# EAGLE board Flightcontroller (EAGLE 9.3.2)
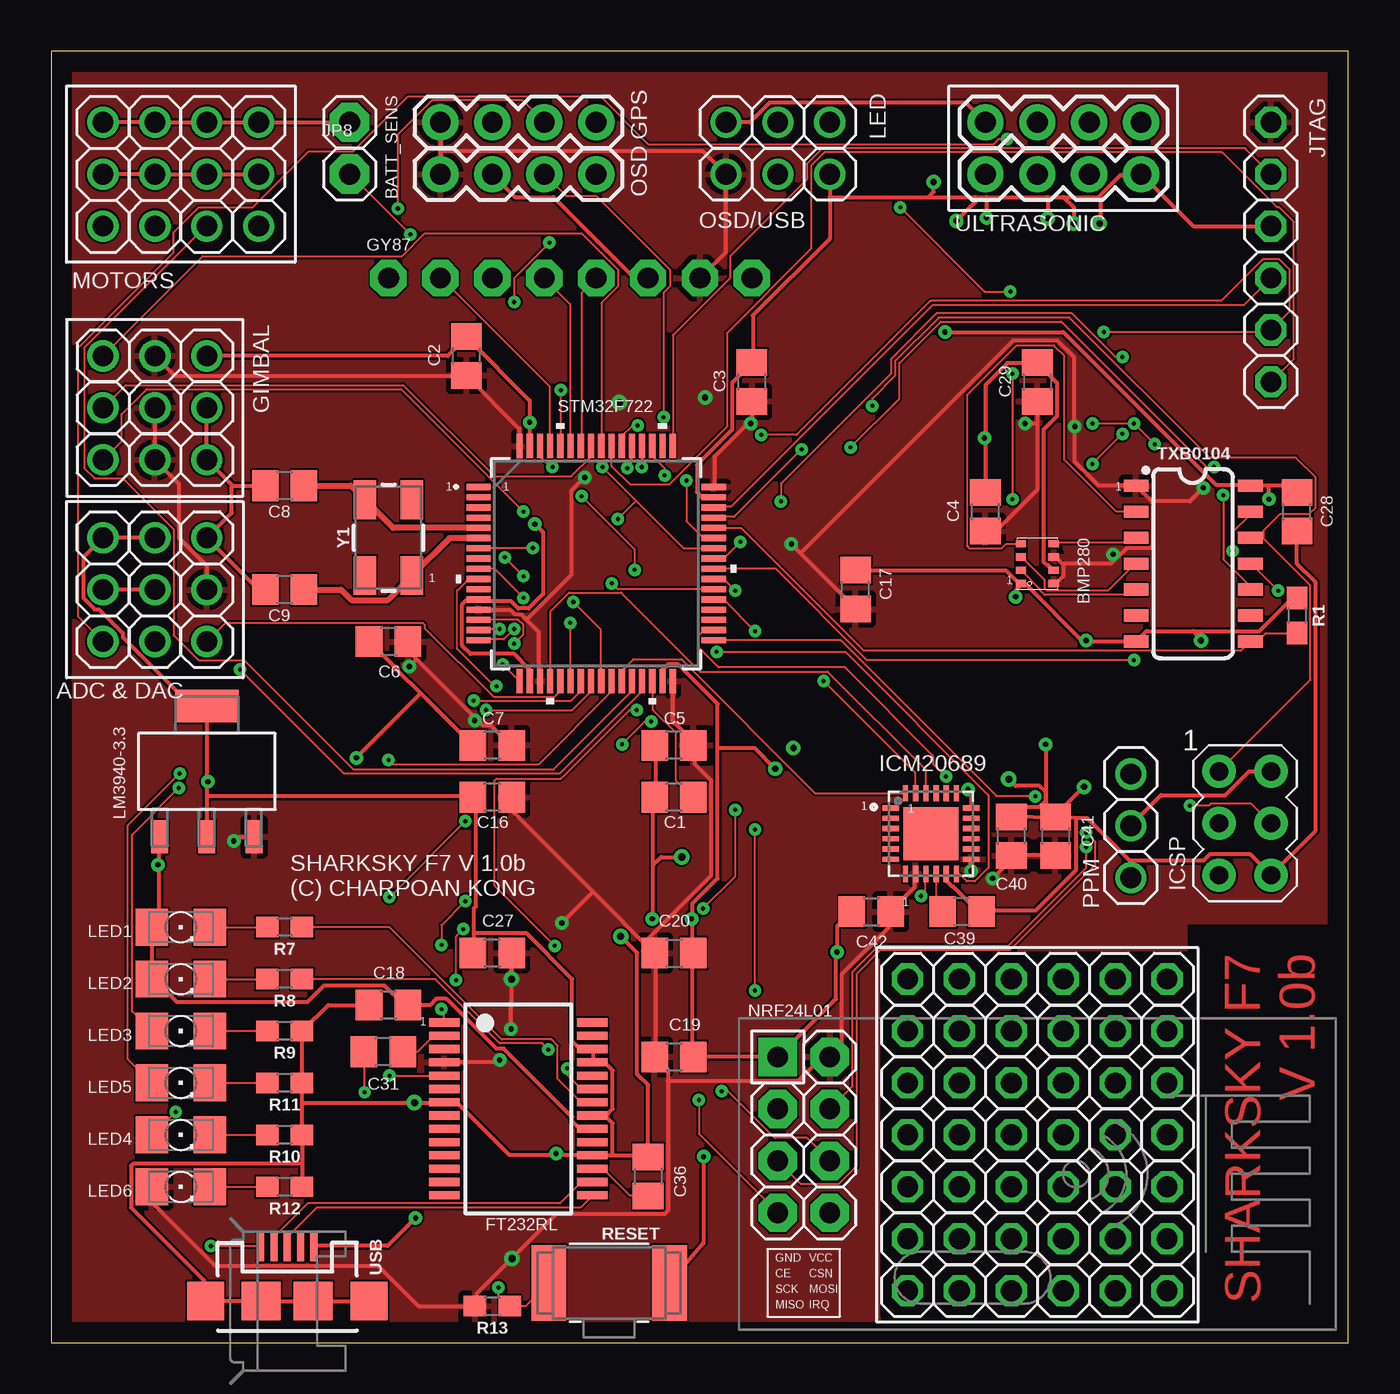
[diagram p10: board, top side]
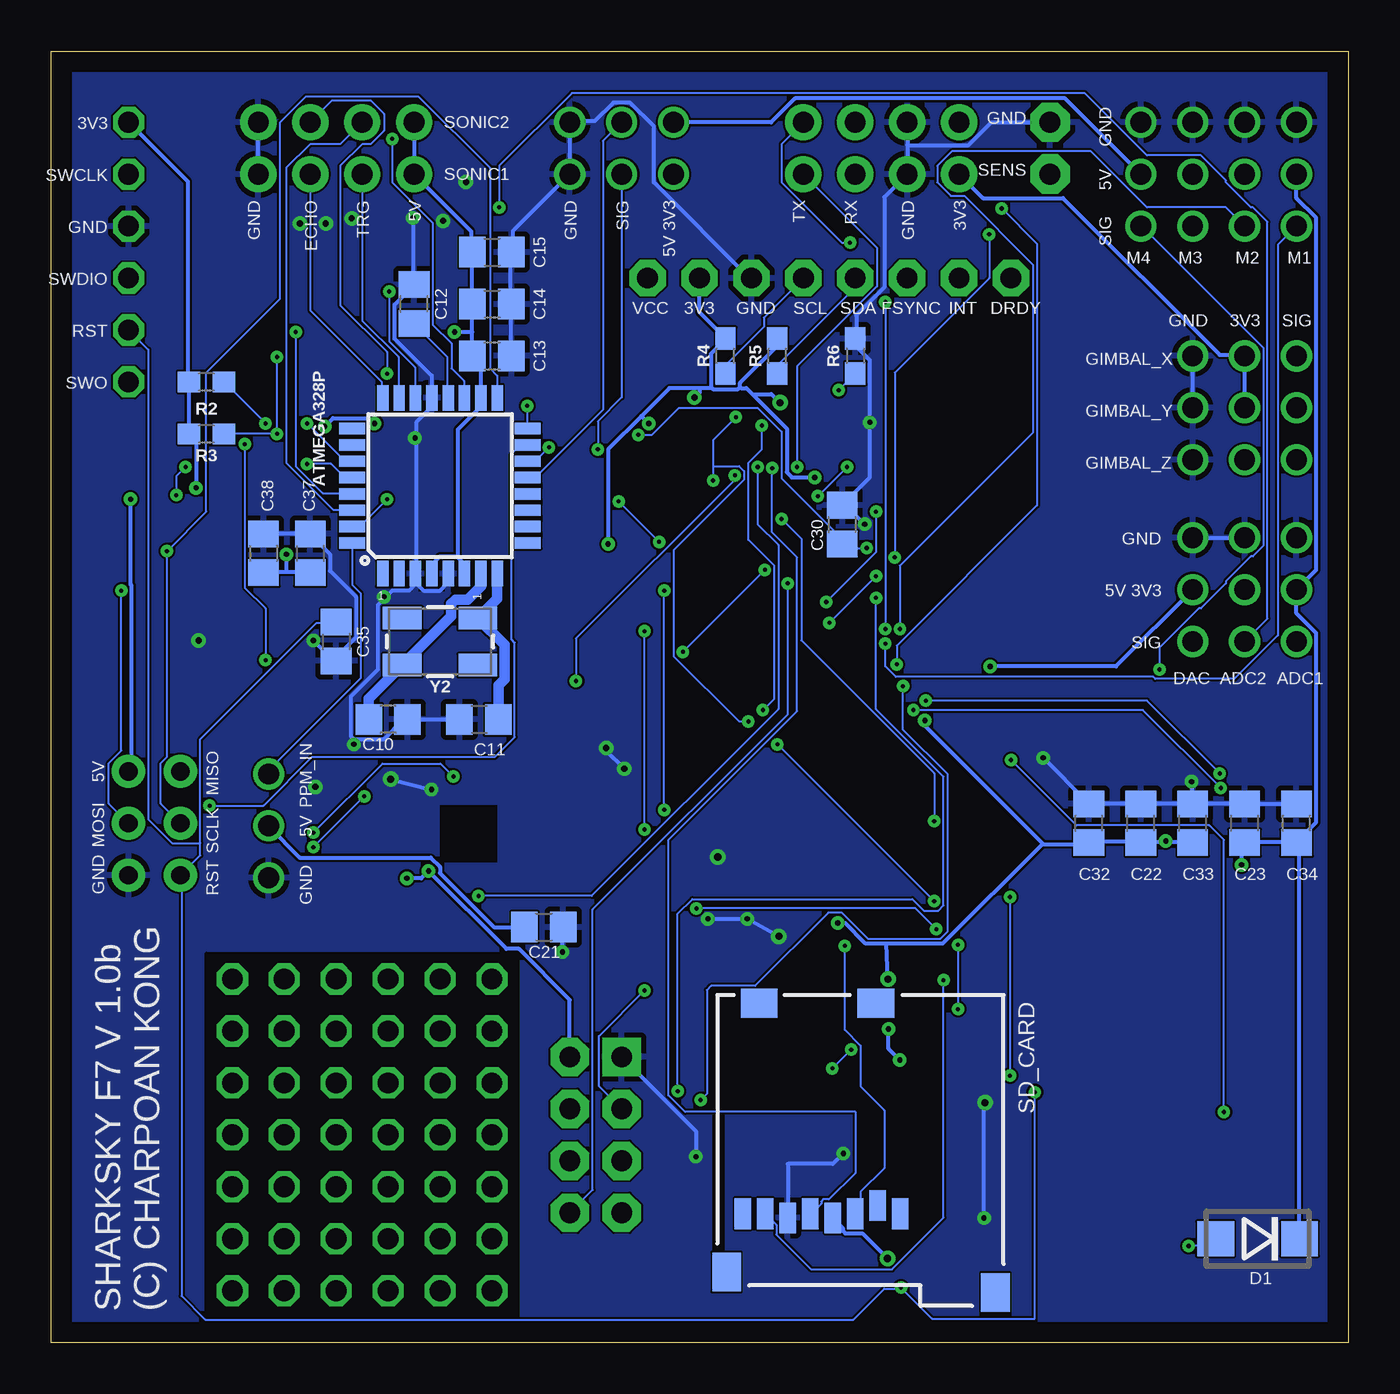
[diagram p11: board, bottom side, seen from below]

Size 63.48 x 63.17 mm. Coordinates in mm from the lower left corner, seen from the top.
Outline: 0,0 63.48,0 63.48,63.17 0,63.17 0,0
Copper layers (1*16): Top 0.035mm / dielectric 0.62mm / Bottom 0.035mm
Design rules "default *": minimum track width 4mil, minimum drill 8mil, track to track 4mil, track to pad 4mil, pad to pad 4mil, via to via 4mil, smd to smd 4mil, copper to edge 40mil, drill to drill 6mil, minimum pad ring 10mil, minimum via ring 8mil, stop-mask expansion 4mil, vias tented up to drill 14mil, thermal gap 10mil
Net classes: 0 default: width 0.102 mm, drill 0.102 mm, clearance 0.102 mm; 1 Supply: width 0.203 mm, drill 0.254 mm, clearance 0.102 mm
tKeepout: area 40.6,1.3 to 55.9,19.1; area 41.7,23.5 to 44.5,26.3; area 55.5,0.3 to 63.4,20.2
bKeepout: area 40.6,1.3 to 55.9,19.1; area 41.7,23.5 to 44.5,26.3
tRestrict: area 40.6,1.3 to 55.9,19.1; area 41.7,23.5 to 44.5,26.3; area 55.6,0.3 to 63.4,20.4
bRestrict: area 40.6,1.3 to 55.9,19.1; area 41.7,23.5 to 44.5,26.3

## Footprints (pad centres in the part's own frame; a part is rotated, then mirrored left to right if it is on the bottom)
1X03 = drill 1.016: 1 -2.54,0; 2 0,0; 3 2.54,0
TQFP32-08 = smd 1.27 x 0.559: 1 -4.293,2.8; 2 -4.293,2; 3 -4.293,1.2; 4 -4.293,0.4; 5 -4.293,-0.4; 6 -4.293,-1.2; 7 -4.293,-2; 8 -4.293,-2.8; 17 4.293,-2.8; 18 4.293,-2; 19 4.293,-1.2; 20 4.293,-0.4; 21 4.293,0.4; 22 4.293,1.2; 23 4.293,2; 24 4.293,2.8 | smd 0.559 x 1.27: 9 -2.8,-4.293; 10 -2,-4.293; 11 -1.2,-4.293; 12 -0.4,-4.293; 13 0.4,-4.293; 14 1.2,-4.293; 15 2,-4.293; 16 2.8,-4.293; 25 2.8,4.293; 26 2,4.293; 27 1.2,4.293; 28 0.4,4.293; 29 -0.4,4.293; 30 -1.2,4.293; 31 -2,4.293; 32 -2.8,4.293
1X01 = drill 1.016 pad 1.93 octagon: 1 0,0
BMP280 = smd 0.35 x 0.5: 1 0.975,-0.8; 2 0.325,-0.8; 3 -0.325,-0.8; 4 -0.975,-0.8; 5 -0.975,0.8; 6 -0.325,0.8; 7 0.325,0.8; 8 0.975,0.8
C0805 = smd 1.3 x 1.5: 1 -0.95,0; 2 0.95,0
DO214BA = smd 1.8 x 1.7: A 2.05,0; C -2.05,0
SSOP28 = smd 0.4 x 1.5: 1 -4.225,-3.625; 2 -3.575,-3.625; 3 -2.925,-3.625; 4 -2.275,-3.625; 5 -1.625,-3.625; 6 -0.975,-3.625; 7 -0.325,-3.625; 8 0.325,-3.625; 9 0.975,-3.625; 10 1.625,-3.625; 11 2.275,-3.625; 12 2.925,-3.625; 13 3.575,-3.625; 14 4.225,-3.625; 15 4.225,3.625; 16 3.575,3.625; 17 2.925,3.625; 18 2.275,3.625; 19 1.625,3.625; 20 0.975,3.625; 21 0.325,3.625; 22 -0.325,3.625; 23 -0.975,3.625; 24 -1.625,3.625; 25 -2.275,3.625; 26 -2.925,3.625; 27 -3.575,3.625; 28 -4.225,3.625
1X04-BIG = drill 1.016 pad 1.778: 1 0,0; 2 2.54,0; 3 5.08,0; 4 7.62,0
1X08-CLEANBIG = drill 1.016 pad 1.778 octagon: 1 -8.89,0; 2 -6.35,0; 3 -3.81,0; 4 -1.27,0; 5 1.27,0; 6 3.81,0; 7 6.35,0; 8 8.89,0
QFN50P400X400X95-25N = smd 0.79 x 0.26: 1 -1.97,1.25; 2 -1.97,0.75; 3 -1.97,0.25; 4 -1.97,-0.25; 5 -1.97,-0.75; 6 -1.97,-1.25; 13 1.97,-1.25; 14 1.97,-0.75; 15 1.97,-0.25; 16 1.97,0.25; 17 1.97,0.75; 18 1.97,1.25 | smd 0.26 x 0.79: 7 -1.25,-1.97; 8 -0.75,-1.97; 9 -0.25,-1.97; 10 0.25,-1.97; 11 0.75,-1.97; 12 1.25,-1.97; 19 1.25,1.97; 20 0.75,1.97; 21 0.25,1.97; 22 -0.25,1.97; 23 -0.75,1.97; 24 -1.25,1.97 | smd 2.7 x 2.6: 25 0,0
AVRISP = drill 0.9 pad 1.626: 1 -1.27,2.54; 2 1.27,2.54; 3 -1.27,0; 4 1.27,0; 5 -1.27,-2.54; 6 1.27,-2.54
1X06 = drill 1.016 octagon: 1 -6.35,0; 2 -3.81,0; 3 -1.27,0; 4 1.27,0; 5 3.81,0; 6 6.35,0
1206 = smd 1.6 x 1.803: A -1.422,0; C 1.422,0
SOT230P696X180-4N = smd 1.6 x 0.838: 1 -3.2,2.311; 2 -3.2,0; 3 -3.2,-2.311 | smd 1.6 x 3.099: 4 3.2,0
NRF24L01+ = drill 1.016 pad 1.88 octagon: CE -11.43,1.27; CSN -8.89,1.27; IRQ -8.89,-3.81; MISO -11.43,-3.81; MOSI -8.89,-1.27; SCK -11.43,-1.27; VCC -8.89,3.81 | drill 1.016 pad 1.88 square: GND -11.43,3.81
0603 = smd 1.1 x 1: 1 -0.85,0; 2 0.85,0
BTN_CK_KSS = smd 1.7 x 3.7: P$1 -2.95,0; P$2 2.95,0
3M_2908-05WB-MG = smd 0.8 x 1.5: 1 -1.94,3.1; 2 -0.84,2.7; 3 0.26,3.1; 4 1.36,3.3; 5 2.46,3.1; 6 3.56,3.3; 7 4.66,3.1; 8 5.76,3.1 | smd 1.4 x 1.9: P$1 6.55,5.95; P$2 -6.6,6.95 | smd 1.8 x 1.4: P$3 4.95,-7.2; P$4 -0.75,-7.2
LQFP64-10X10MM = smd 1.194 x 0.305: 1 -5.75,3.75; 2 -5.75,3.25; 3 -5.75,2.75; 4 -5.75,2.25; 5 -5.75,1.75; 6 -5.75,1.25; 7 -5.75,0.75; 8 -5.75,0.25; 9 -5.75,-0.25; 10 -5.75,-0.75; 11 -5.75,-1.25; 12 -5.75,-1.75; 13 -5.75,-2.25; 14 -5.75,-2.75; 15 -5.75,-3.25; 16 -5.75,-3.75; 33 5.75,-3.75; 34 5.75,-3.25; 35 5.75,-2.75; 36 5.75,-2.25; 37 5.75,-1.75; 38 5.75,-1.25; 39 5.75,-0.75; 40 5.75,-0.25; 41 5.75,0.25; 42 5.75,0.75; 43 5.75,1.25; 44 5.75,1.75; 45 5.75,2.25; 46 5.75,2.75; 47 5.75,3.25; 48 5.75,3.75 | smd 0.305 x 1.194: 17 -3.75,-5.75; 18 -3.25,-5.75; 19 -2.75,-5.75; 20 -2.25,-5.75; 21 -1.75,-5.75; 22 -1.25,-5.75; 23 -0.75,-5.75; 24 -0.25,-5.75; 25 0.25,-5.75; 26 0.75,-5.75; 27 1.25,-5.75; 28 1.75,-5.75; 29 2.25,-5.75; 30 2.75,-5.75; 31 3.25,-5.75; 32 3.75,-5.75; 49 3.75,5.75; 50 3.25,5.75; 51 2.75,5.75; 52 2.25,5.75; 53 1.75,5.75; 54 1.25,5.75; 55 0.75,5.75; 56 0.25,5.75; 57 -0.25,5.75; 58 -0.75,5.75; 59 -1.25,5.75; 60 -1.75,5.75; 61 -2.25,5.75; 62 -2.75,5.75; 63 -3.25,5.75; 64 -3.75,5.75
SO14 = smd 0.6 x 1.2: 1 -3.81,-2.8; 2 -2.54,-2.8; 3 -1.27,-2.8; 4 0,-2.8; 5 1.27,-2.8; 6 2.54,-2.8; 7 3.81,-2.8; 8 3.81,2.8; 9 2.54,2.8; 10 1.27,2.8; 11 0,2.8; 12 -1.27,2.8; 13 -2.54,2.8; 14 -3.81,2.8
USB-MICROB = smd 1.4 x 0.35: D+ -2.65,0; D- -2.65,-0.65; GND -2.65,1.3; ID -2.65,0.65; VBUS -2.65,-1.3 | smd 1.9 x 1.8: MT1 0,-4; MT2 0,4 | smd 1.9 x 1.9: P$1 0,-1.27; P$2 0,1.27
CRYSTAL-SMD-5X3.2-4PAD = smd 1.9 x 1.1: 1 -1.85,-1.15; 2 1.85,-1.15; 3 1.85,1.15; 4 -1.85,1.15

## Placement (x,y rotation side)
ADC1  [1X03]  2.54,36.83 90 top
ADC2  [1X03]  5.08,36.83 90 top
ATMEGA328P  ATMEGA328P_TQFP  [TQFP32-08]  44.45,41.91 90 bottom
BATT_SENS  [1X01]  14.61,59.69 0 top
BMP280  BMP280  [BMP280]  48.26,38.1 270 top
C1  4.7uF  [C0805]  30.48,26.67 180 top
C2  4.7uF  [C0805]  20.32,48.26 90 top
C3  100nF  [C0805]  34.29,46.99 90 top
C4  100nF  [C0805]  45.72,40.64 90 top
C5  100nF  [C0805]  30.48,29.21 180 top
C6  100nF  [C0805]  16.51,34.29 180 top
C7  100nF  [C0805]  21.59,29.21 180 top
C8  10pF  [C0805]  11.43,41.91 180 top
C9  10pF  [C0805]  11.43,36.83 180 top
C10  10pF  [C0805]  46.99,30.48 180 bottom
C11  10pF  [C0805]  42.55,30.48 0 bottom
C12  100nF  [C0805]  45.72,50.8 90 bottom
C13  4.7uF  [C0805]  41.91,48.26 0 bottom
C14  1uF  [C0805]  41.91,50.8 0 bottom
C15  1uF  [C0805]  41.91,53.34 0 bottom
C16  1uF  [C0805]  21.59,26.67 180 top
C17  1uF  [C0805]  39.37,36.83 90 top
C18  100nF  [C0805]  16.51,16.51 180 top
C19  100nF  [C0805]  30.48,13.97 0 top
C20  4.7uF  [C0805]  30.48,19.05 0 top
C21  4.7uF  [C0805]  39.37,20.32 0 bottom
C22  10uF  [C0805]  10.16,25.4 90 bottom
C23  10uF  [C0805]  5.08,25.4 90 bottom
C27  4.7uF  [C0805]  21.59,19.05 180 top
C28  100nF  [C0805]  60.96,40.64 90 top
C29  100nF  [C0805]  48.26,46.99 270 top
C30  100nF  [C0805]  24.77,40.01 90 bottom
C31  100nF  [C0805]  16.26,14.22 180 top
C32  10uF  [C0805]  12.7,25.4 90 bottom
C33  10uF  [C0805]  7.62,25.4 90 bottom
C34  1uF  [C0805]  2.54,25.4 90 bottom
C35  100nF  [C0805]  49.53,34.29 270 bottom
C36  100nF  [C0805]  29.21,8.13 270 top
C37  100nF  [C0805]  50.8,38.61 270 bottom
C38  100nF  [C0805]  53.09,38.61 270 bottom
C39  0.47uF  [C0805]  44.58,21.08 180 top
C40  10nF  [C0805]  46.99,24.77 90 top
C41  100nF  [C0805]  49.15,24.77 270 top
C42  2.2uF  [C0805]  40.13,21.08 0 top
D1  [DO214BA]  4.44,5.08 180 bottom
DAC  [1X03]  7.62,36.83 90 top
FT232RL  FT232RL  [SSOP28]  22.86,11.43 270 top
GIMBAL_X  [1X03]  5.08,48.26 0 top
GIMBAL_Y  [1X03]  5.08,45.72 0 top
GIMBAL_Z  [1X03]  5.08,43.18 0 top
GPS  1X4-BIG  [1X04-BIG]  19.05,59.69 0 top
GY87  [1X08-CLEANBIG]  25.4,52.07 0 top
ICM20689  ICM-20689  [QFN50P400X400X95-25N]  43.05,24.89 0 top
ICSP  AVRISP-6  [AVRISP]  58.42,25.4 0 top
JP1  [1X06]  48.26,17.78 0 top
JP2  [1X06]  48.26,15.24 0 top
JP3  [1X06]  48.26,12.7 0 top
JP4  [1X06]  48.26,10.16 0 top
JP5  [1X06]  48.26,7.62 0 top
JP6  [1X06]  48.26,5.08 0 top
JP7  [1X06]  48.26,2.54 0 top
JP8  [1X01]  14.61,57.15 0 top
JTAG  [1X06]  59.69,53.34 270 top
LED  [1X03]  35.56,59.69 0 top
LED1  [1206]  6.35,20.32 0 top
LED2  [1206]  6.35,17.78 0 top
LED3  [1206]  6.35,15.24 0 top
LED4  [1206]  6.35,10.16 0 top
LED5  [1206]  6.35,12.7 0 top
LED6  [1206]  6.35,7.62 0 top
LM3940-3.3  LM3940IMPX-3.3/NOPB  [SOT230P696X180-4N]  7.62,27.94 90 top
M1  [1X03]  2.54,57.15 90 top
M2  [1X03]  5.08,57.15 90 top
M3  [1X03]  7.62,57.15 90 top
M4  [1X03]  10.16,57.15 90 top
NRF24L01  NRF24L01+  [NRF24L01+]  46.99,10.16 0 top
OSD  1X4-BIG  [1X04-BIG]  19.05,57.15 0 top
OSD/USB  [1X03]  35.56,57.15 0 top
PPM  [1X03]  52.83,25.27 270 top
R1  10k  [0603]  60.96,35.56 270 top
R2  4.7k  [0603]  55.88,46.99 180 bottom
R3  4.7k  [0603]  55.88,44.45 180 bottom
R4  4.7k  [0603]  30.48,48.26 90 bottom
R5  4.7k  [0603]  27.94,48.26 90 bottom
R6  10k  [0603]  24.13,48.26 270 bottom
R7  1k  [0603]  11.43,20.32 180 top
R8  1k  [0603]  11.43,17.78 180 top
R9  1k  [0603]  11.43,15.24 180 top
R10  1k  [0603]  11.43,10.16 180 top
R11  1k  [0603]  11.43,12.7 180 top
R12  1k  [0603]  11.43,7.62 180 top
R13  10k  [0603]  21.59,1.78 180 top
RESET  [BTN_CK_KSS]  27.3,2.92 0 top
SD_CARD  2908-05WB-MG  [3M_2908-05WB-MG]  23.88,9.4 180 bottom
SONIC1  1X4-BIG  [1X04-BIG]  45.72,59.69 0 top
SONIC2  1X4-BIG  [1X04-BIG]  45.72,57.15 0 top
STM32F722  STM32F7X2RXT  [LQFP64-10X10MM]  26.67,38.1 0 top
TXB0104  TXB0104  [SO14]  55.88,38.1 270 top
USB  [USB-MICROB]  11.56,2.03 270 top
Y1  8MHz  [CRYSTAL-SMD-5X3.2-4PAD]  16.51,39.37 90 top
Y2  16MHz  [CRYSTAL-SMD-5X3.2-4PAD]  44.45,34.29 180 bottom

## Tracks (layer width: path | path; a pad name or v marks a point on that pad's centre or on a via)
A_SPI_MISO  (via drill 0.2)
  Top 0.102: TXB0104.12 59.28,39.37 59.31,39.35 | 59.31,39.35 61.62,37.03 61.62,32.41 ICSP.1 | v40.18,45.82 40.18,46.18 41.3,47.3 41.3,48.01 43.43,50.14 49.84,50.14 56.69,43.28 60.91,43.28 61.87,42.32 61.87,40.84 61.57,40.54 60.15,40.54 59.33,39.73 59.33,39.37 59.31,39.35
  Bottom 0.102: v40.18,45.82 40.18,44.76 ATMEGA328P.16
A_SPI_MOSI  (via drill 0.2)
  Top 0.102: v60.05,36.78 58.73,38.1 TXB0104.11 | v55.73,26.26 56.64,26.26 56.74,26.37 58.73,26.37 ICSP.4
  Bottom 0.102: v60.05,36.78 60.05,28.96 60.66,28.35 60.66,26.37 ICSP.4 | v55.73,26.26 53.09,26.26 50.7,28.65 41.76,28.65 40.79,29.62 40.79,34.24 40.95,34.39 40.95,43.49 40.54,43.89 40.18,43.89 ATMEGA328P.15
A_SPI_NSS  (via drill 0.2)
  Top 0.102: v57.35,41.45 57.35,38.3 58.67,36.98 TXB0104.10 | v56.9,42.82 56.54,42.82 49.43,49.94 43.54,49.94 41.5,47.9 41.5,46.18 v39.12,43.79
  Bottom 0.102: v57.35,41.45 57.35,42.37 v56.9,42.82 | v39.12,43.79 39.78,43.13 40.13,43.13 ATMEGA328P.14
A_SPI_SCLK  (via drill 0.2)
  Top 0.102: v57.81,38.71 57.81,39.62 58.67,40.49 TXB0104.13
  Bottom 0.102: ICSP.3 58.12,26.37 58.12,28.35 57.81,28.65 v57.81,38.71 55.88,40.64 55.88,47.45 52.27,51.05 52.27,59.69 51,60.96 45.52,60.96 42.01,57.46 42.01,47.65 41.66,47.3 41.66,46.23 ATMEGA328P.17
ADC1  (via drill 0.2)
  Top 0.102: v46.79,58.88 46.38,58.88 46.13,58.62 29.21,58.62 26.87,60.96 17.48,60.96 14.78,58.27 12.6,58.27 9.86,55.52 7.21,55.52 5.99,54.3 5.99,53.34 1.32,48.67 1.32,35.51 ADC1.1
  Bottom 0.102: v46.79,58.88 46.79,56.74 44.81,54.76 44.81,49.78 43.89,48.87 43.89,47.65 43.28,47.04 43.28,46.23 ATMEGA328P.19
ADC2  (via drill 0.2)
  Top 0.102: v46.94,51.41 45.67,51.41 v41.55,55.52
  Bottom 0.102: v46.94,51.41 46.94,48.97 45.67,47.7 45.67,46.23 ATMEGA328P.22 | v41.55,55.52 41.55,57.56 38,61.11 12.9,61.11 9.86,58.06 7.21,58.06 5.99,56.85 5.99,56.74 4.77,55.52 4.67,55.52 3.96,54.81 3.96,35.41 ADC2.1
B_SPI_MISO
  Top 0.102: BMP280.5 49.07,39.12 52.78,39.12 53.04,39.37 TXB0104.3
B_SPI_MOSI
  Top 0.102: BMP280.3 47.5,38.41 48.62,37.29 48.62,36.88 48.72,36.78 51.71,36.78 53.04,38.1 TXB0104.4
B_SPI_NSS
  Top 0.102: BMP280.2 47.5,37.74 48.41,36.83 48.41,36.78 48.62,36.58 52.78,36.58 53.04,36.83 TXB0104.5
B_SPI_SCLK
  Top 0.102: TXB0104.2 52.12,40.64 49.58,43.18 49.58,48.26 49.07,48.77 47.24,48.77 44.81,46.33 44.81,38.96 44.91,38.86 46.53,38.86 46.74,39.07 47.45,39.07 BMP280.4
BATTSENS  (via drill 0.2)
  Top 0.102: v25.4,35.2 25.4,32.36 STM32F722.22 | v22.2,38.41 v23.11,37.49 | v17.58,54.2 14.63,57.15 JP8.1
  Bottom 0.102: v23.11,37.49 v25.4,35.2 | v22.2,38.41 22.2,47.45 17.58,52.07 v17.58,54.2
CE  (via drill 0.2)
  Top 0.102: v34.44,34.8 32.92,36.32 32.46,36.32 STM32F722.37 | v34.44,17.22 v34.44,25.1
  Bottom 0.102: v34.44,25.1 v34.44,34.8 | v34.44,17.22 36.68,14.99 36.68,12.55 NRF24L01.CE
DAC_OUT
  Top 0.102: DAC.1 8.53,35.2 18.19,35.2 18.29,35.1 18.29,34.95 21.64,31.6 24.64,31.6 24.89,31.85 24.89,32.31 STM32F722.21
ECHO1_IN  (via drill 0.2)
  Top 0.102: v47.04,47.4 v47.04,41.25
  Bottom 0.102: v47.04,41.25 48.36,39.93 48.72,39.93 ATMEGA328P.31 | v47.04,47.4 47.04,48.46 49.33,50.75 49.33,57.56 48.26,58.62 47.85,58.62 47.19,59.28 47.19,60.1 47.85,60.76 49.73,60.76 SONIC1.3
ECHO2_IN
  Bottom 0.102: SONIC2.3 50.8,50.49 47.3,46.99 47.3,46.23 ATMEGA328P.24
GIMBAL_X
  Top 0.102: GIMBAL_X.1 7.42,53.14 17.17,53.14 18.29,54.25 25.96,54.25 27.74,52.48 27.74,51.66 26.92,50.85 26.92,43.89 STM32F722.56
GIMBAL_Y
  Top 0.102: GIMBAL_Y.1 3.66,46.84 17.22,46.84 21.69,42.37 25.45,42.37 26.42,43.33 STM32F722.57
GIMBAL_Z  (via drill 0.2)
  Top 0.102: v25.55,36.22 26.87,34.9 26.87,32.36 STM32F722.25 | v23.11,40.64 17.12,46.63 4.67,46.63 3.45,45.41 3.45,44.09 GIMBAL_Z.1
  Bottom 0.102: v25.55,36.22 23.11,38.66 v23.11,40.64
GND  (via drill 0.25, 0.3, 0.35)
  Top 0.203: v17.83,6.1 16.46,4.72 12.9,4.72 USB.GND | C5.2 29.57,29.21 29.57,26.67 C1.2 29.46,26.62 29.46,23.37 | 32.61,29.08 32.61,22.71 31.39,21.49 31.39,20.73 | 32.61,29.08 32.61,31.24 30.68,33.17 30.17,33.17 29.92,32.92 STM32F722.31 | 31.39,20.73 31.39,19.05 C20.2 31.39,19 31.39,14.02 C19.2 NRF24L01.GND 38.41,16.82 38.41,19.05 v38.46,19.1 38.46,20.37 39.17,21.08 C42.1 | 29.46,23.37 29.46,20.78 v29.41,20.73 | v31.34,20.73 31.39,20.73 | v31.93,9.09 31.93,4.87 RESET.P$2 | 8.89,41.91 C8.2 | 8.89,41.91 GIMBAL_Z.3 GIMBAL_Y.3 | 18.09,31.75 20.62,29.21 C7.2 | 18.09,31.75 16.97,32.87 16.97,32.92 15.6,34.29 C6.2 | 7.62,27.43 LM3940-3.3.4 7.57,31.19 6.81,31.19 3.5,34.49 3.5,34.7 2.34,35.87 2.13,35.87 1.57,36.42 1.57,38.41 ADC1.3 ADC2.3 | 7.62,27.43 7.62,26.72 | 7.62,26.72 LM3940-3.3.2 | C9.2 10.16,36.83 DAC.3 8.84,40.59 8.84,41.86 8.89,41.91 | v7.67,27.43 7.62,27.43 | v14.94,28.6 18.09,31.75 | 20.68,20.02 20.68,21.23 20.78,21.34 20.78,26.57 20.68,26.67 C16.2 20.57,26.72 7.62,26.72 | 20.68,20.02 20.68,19.05 C27.2 | 27.48,9.14 29.16,9.14 29.21,9.09 C36.1 29.21,12.6 28.68,13.14 28.68,19.07 v27.87,19.87 | 27.48,9.14 26.52,9.14 FT232RL.18 26.42,9.2 24.71,9.2 | 27.48,9.14 27.48,10.72 27.13,11.07 26.52,11.07 FT232RL.21 27.18,11.12 27.48,11.43 27.48,13.31 27.08,13.72 26.62,13.72 FT232RL.25 26.52,13.72 26.52,14.33 FT232RL.26 26.42,14.43 25.81,14.43 25.5,14.73 25.5,17.78 23.27,20.02 20.68,20.02 | USB.MT2 USB.P$2 USB.P$1 USB.MT1 7.47,2.08 7.47,3.05 3.91,6.6 3.91,8.64 4.01,8.74 12.29,8.74 | 12.29,8.74 12.29,10.16 R10.1 12.29,10.21 12.29,11.73 | 12.29,8.74 12.29,7.62 R12.1 | 12.29,11.73 12.29,12.7 R11.1 12.29,12.75 12.29,15.24 R9.1 12.34,15.29 13.56,16.51 C18.2
  Top 0.203: 12.29,11.73 v17.78,11.73 19.2,11.73 FT232RL.7 19.3,11.68 19.91,11.68 22.4,9.2 24.71,9.2 | v24.71,9.25 24.71,9.2 | ICM20689.11 43.84,22.86 43.84,22.55 44.09,22.3 44.15,22.3 45.36,21.08 C39.1 45.62,21.13 48.16,21.13 50.14,23.11 50.14,25.65 | 50.14,25.65 50.7,25.65 52.83,23.52 | PPM.3 52.83,23.52 | C28.1 60.96,38.1 61.87,37.19 61.87,25.04 ICSP.6 58.67,23.88 56.69,23.88 56.39,23.57 52.88,23.57 52.83,23.52 | BMP280.7 49.02,37.8 48.82,38 48.77,38 48.57,38.2 48.57,44.65 49.23,45.31 49.23,46.94 48.26,47.9 C29.1 48.21,47.9 46.79,47.9 45.72,46.84 45.72,44.25 | 45.72,44.25 C4.2 | v45.67,44.25 45.72,44.25 | 50.65,34.29 TXB0104.7 53.14,34.34 53.59,34.8 55.88,34.8 | 50.65,34.29 50.5,34.29 47.7,37.08 47.5,37.08 BMP280.1 | 55.88,34.8 59.13,34.8 60.71,36.37 60.96,36.37 R1.1 | C17.2 39.37,37.74 46.74,37.74 47.4,37.08 BMP280.1 | v50.65,34.34 50.65,34.29 | v47.19,36.47 47.19,36.78 47.4,36.98 BMP280.1 | v48.67,29.26 48.67,25.76 C41.1 | JTAG.3 55.88,54.61 SONIC2.4 53.29,57.1 52.32,57.1 51.33,56.11 | STM32F722.47 31.85,41.35 31.6,41.6 31.6,42.93 33.33,44.65 33.33,46.94 34.29,47.9 C3.2 34.34,48.01 34.34,50.24 38.1,54 38.1,56.03 | OSD/USB.3 38.1,56.03 | 51.33,56.11 51.26,56.03 49.53,56.03 | 38.1,56.03 42.93,56.03 | 42.93,56.03 45.21,56.03 | 45.21,56.03 45.77,56.03 | 45.77,56.03 48.77,56.03 | 48.77,56.03 49.53,56.03 | STM32F722.63 23.42,43.89 v23.42,45.01 23.42,46.08 20.32,49.17 C2.2 20.27,49.12 19.41,48.26 GIMBAL_X.3 | STM32F722.18 23.42,32.92 22.66,33.68 20.52,33.68 20.12,34.09 20.12,36.12 20.32,36.32 20.88,36.32 STM32F722.12 20.98,36.27 22.5,36.27 22.86,35.92 23.37,35.92 24.08,36.63 24.08,39.62 v23.67,40.03
  Top 0.203: M1.3 M2.3 M3.3 M4.3 BATT_SENS.1 | GY87.6 28.55,52.07 24.59,56.03 22.71,56.03 OSD.2 | 45.77,56.03 v45.77,55.02 | 29.46,23.37 29.84,23.75 v30.86,23.75 | 42.93,56.03 43.18,56.29 v43.18,56.77 | 45.21,56.03 45.21,55.78 v44.3,54.86 | 49.53,56.03 50.04,55.52 v50.04,54.74 | 48.77,56.03 v48.77,54.99 | 51.33,56.11 51.33,54.76 v51.31,54.74 | 55.88,34.8 56.26,34.42 v56.26,34.34 | 32.61,29.08 34.42,29.08 v35.43,28.07 | C41.1 49.15,25.78 v50.55,27.18 | ICM20689.18 45.02,26.89 v44.87,27.05 | 48.37,26.21 48.67,26.51 48.67,26.93 48.37,27.23 47.19,27.23 v46.86,27.56 | 48.37,26.21 47.49,26.21 C40.2 49.15,25.67 | 50.14,25.65 49.15,25.67 | 48.37,26.21 49.15,25.67 | C41.1 49.15,25.67
  Bottom 0.203: v31.34,20.73 v29.41,20.73 v27.87,19.87 | v38.46,19.1 38.46,20.32 C21.2 | v31.93,9.09 31.93,10.34 NRF24L01.GND | v24.71,9.25 25.22,8.74 27.43,8.74 27.43,6.74 27.44,6.73 SD_CARD.6 | GIMBAL_Y.3 GIMBAL_X.3 | C34.2 2.54,26.37 5.08,26.37 C23.2 5.13,26.37 7.62,26.37 C33.2 | C33.2 7.67,26.37 10.16,26.37 C22.2 10.21,26.37 12.7,26.37 C32.2 12.75,26.42 v14.94,28.6 | DAC.3 ADC2.3 | v7.67,27.43 7.67,26.47 C33.2 | C11.1 C10.1 46.13,30.43 46.28,30.43 47.19,29.52 48.67,29.52 | ATMEGA328P.5 44.09,37.59 44.09,37.13 44.45,36.78 45.26,36.78 45.62,37.13 45.62,37.59 ATMEGA328P.3 | 45.62,44.25 45.62,45.01 44.91,45.72 44.91,46.13 ATMEGA328P.21 44.86,46.23 44.86,47.3 46.69,49.12 46.69,50.75 45.72,51.71 C12.2 45.77,51.82 v45.77,55.02 | 45.62,44.25 45.62,37.69 ATMEGA328P.3 | 48.67,29.52 48.82,29.67 48.82,31.6 47.5,32.92 47.5,36.07 47.14,36.42 | 47.14,36.42 46.79,36.78 45.97,36.78 45.67,37.08 ATMEGA328P.3 | v45.67,44.25 45.62,44.25 | C38.1 53.09,39.57 50.85,39.57 C37.1 50.8,39.52 49.84,38.56 49.84,37.74 48.57,36.47 48.57,34.49 49.53,33.53 C35.2 49.58,33.58 49.89,33.58 v50.65,34.34 | v47.19,36.47 47.14,36.42 | 48.67,29.52 v48.67,29.26 | SONIC2.4 SONIC1.4 | C13.2 41,48.26 41,50.8 C14.2 41,50.85 41,53.34 C15.2 40.89,53.39 40.89,54.36 OSD/USB.3 LED.3 38.05,59.74 36.88,59.74 35.97,60.66 35.15,60.66 33.98,59.49 33.98,56.74 29.31,52.07 GY87.6 | v23.67,40.03 24.64,41 C30.2 24.74,41 23.42,42.32 v23.42,45.01 23.42,48.06 24.13,48.77 R6.1 24.08,49.17 24.08,50.24 22.71,51.61 22.71,56.03 OSD.2 21.59,58.57 | GPS.2 21.59,58.57 | BATT_SENS.1 17.48,59.69 18.59,58.57 21.59,58.57 | v35.43,28.07 36.32,28.96 v36.32,29.08
  Bottom 0.203: v17.78,11.73 17.83,11.68 v17.83,6.1 | v46.86,27.56 v44.87,27.05
  pour Bottom: 63.5,0 63.5,63.12 0,63.12 0,-0.13 63.37,-0.13
I2C1_SCL
  Top 0.102: GY87.5 25.96,51.36 25.96,43.89 STM32F722.58
  Bottom 0.102: R4.1 30.48,47.8 28.6,49.68 28.6,50.14 GY87.5
I2C1_SDA
  Top 0.102: GY87.4 25.4,50.8 25.4,43.89 STM32F722.59
  Bottom 0.102: R5.1 27.94,47.8 24.13,51.61 GY87.4
I2C2_SCL  (via drill 0.2)
  Top 0.102: v50.95,42.98 v52.43,44.45 | v33.73,39.17 32.92,38.35 32.46,38.35 STM32F722.41 | v35.71,41.15 35.71,42.01 41.1,47.4 41.1,48.11 43.33,50.34 49.94,50.34 52.07,48.21 v52.43,48.21
  Bottom 0.102: R3.1 v52.43,44.45 v52.43,48.21 | v50.95,42.98 49.78,42.98 49.12,42.32 48.77,42.32 ATMEGA328P.28 | v35.71,41.15 v33.73,39.17
I2C2_SDA  (via drill 0.2)
  Top 0.102: v50.95,44.96 v52.98,44.96 v54,43.94 | v52.98,33.38 39.93,33.38 35.46,37.85 32.46,37.85 STM32F722.40
  Bottom 0.102: v52.98,44.96 55.02,46.99 R2.1 | v50.95,44.96 49.12,43.13 48.77,43.13 ATMEGA328P.27 | v52.98,33.38 52.98,35.92 54,36.93 v54,43.94
IMU_INT  (via drill 0.2)
  Top 0.102: v32.56,33.78 38.86,33.78 45.87,26.77 45.87,23.22 45.21,22.55 44.81,22.55 44.45,22.91 44.35,22.91 ICM20689.12 | v28.55,37.8 28.55,38.81 v25.96,41.4 | v24.54,42.82 24.44,42.82 23.93,43.33 STM32F722.62
  Bottom 0.102: v28.55,37.8 v32.56,33.78 | v24.54,42.82 v25.96,41.4
INIT_OK  (via drill 0.2)
  Top 0.102: v20.68,31.39 25.45,31.39 25.91,31.85 25.91,32.31 STM32F722.23 | v6.3,27.84 3.76,25.3 3.76,13.87 LED5.A | LED5.A
  Bottom 0.102: v20.68,31.39 9.86,31.39 v6.3,27.84
INTA
  Top 0.102: GY87.2 19.1,52.07 24.38,46.79 24.38,43.89 STM32F722.61
IRQ  (via drill 0.2)
  Top 0.102: v27.43,37.13 27.69,36.88 32.41,36.88 STM32F722.38
  Bottom 0.102: v27.43,37.13 27.43,30.73 36.98,21.18 36.98,7.47 NRF24L01.IRQ
LED
  Bottom 0.102: LED.2 36.47,58.78 36.47,45.62 39.78,42.32 40.13,42.32 ATMEGA328P.13
LED_RX  (via drill 0.2)
  Top 0.102: R8.1 18.8,17.78 21.95,14.63 24.03,14.63 v24.33,14.33 | v25.25,13.41 25.25,13.11 25.91,12.45 26.47,12.45 FT232RL.23
  Bottom 0.102: v25.25,13.41 v24.33,14.33
LED_TX
  Top 0.102: R7.1 16.56,20.32 22.05,14.83 24.49,14.83 24.79,14.53 24.79,12.9 25.91,11.79 26.47,11.79 FT232RL.22
LLVOE
  Top 0.102: R1.2 60.96,34.7 59.44,34.7 59.03,34.29 TXB0104.8 58.22,33.83 39.78,33.83 33.78,39.83 32.46,39.83 STM32F722.44
MOD0_LED  (via drill 0.2)
  Top 0.102: v21.29,30.94 25.5,30.94 26.42,31.85 26.42,32.31 STM32F722.24 | v6.25,27.13 3.96,24.84 3.96,16.21 LED3.A | LED3.A
  Bottom 0.102: v21.29,30.94 10.06,30.94 v6.25,27.13
MOD1_LED  (via drill 0.2)
  Top 0.102: v16.51,28.5 16.71,28.3 23.88,28.3 27.38,31.8 27.38,32.31 STM32F722.26 | v6.1,11.28 4.98,10.16 LED4.A
  Bottom 0.102: v16.51,28.5 13.31,25.3 6.81,25.3 6.1,24.59 v6.1,11.28
N$1
  Top 0.102: STM32F722.30 29.46,32.31 29.46,30.94 30.58,29.82 30.58,27.48 31.39,26.67 C1.1
N$2
  Top 0.305: STM32F722.5 16.73,39.85 Y1.3 14.67,41.91 C8.1
N$3
  Top 0.305: STM32F722.6 19.49,39.35 Y1.1 16.46,36.32 14.71,36.32 14.19,36.83 C9.1
N$4
  Bottom 0.102: ATMEGA328P.20 44.09,46.23 44.09,48.21 45.72,49.84 C12.1
N$6
  Bottom 0.508: ATMEGA328P.7 42.45,36.99 43.09,36.35 43.7,36.35 43.91,36.14 43.91,35.53 Y2.3 47.94,31.5 C10.2
N$7
  Bottom 0.508: ATMEGA328P.8 41.65,36.39 Y2.1 41.29,34.13 41.29,32.44 41.59,32.14 C11.2
N$8  (via drill 0.2)
  Top 0.102: v24.94,46.58 24.94,43.89 STM32F722.60
  Bottom 0.102: v24.94,46.58 24.13,47.4 R6.2
N$9
  Top 0.102: C31.1 17.93,14.22 18.69,14.99 19.2,14.99 FT232RL.2
N$10
  Top 0.102: C36.2 29.21,7.21 28.3,7.21 27.03,8.48 26.52,8.48 FT232RL.17
N$13
  Top 0.102: LED1.C R7.2
N$14
  Top 0.102: LED2.C R8.2
N$15
  Top 0.102: LED3.C R9.2
N$16
  Top 0.102: LED4.C R10.2
N$17
  Top 0.102: LED5.C R11.2
N$18
  Top 0.102: LED6.C R12.2
N$24
  Top 0.102: ICM20689.10 43.33,22.91 43.33,21.34 43.59,21.08 C39.2
PPM_IN
  Bottom 0.102: PPM.1 52.83,27.99 48.31,32.51 48.31,36.63 48.72,37.03 48.72,39.07 ATMEGA328P.32
PWM_1  (via drill 0.2)
  Top 0.102: v22.66,34.19 23.11,34.65 23.11,35.1 22.86,35.36 STM32F722.14
  Bottom 0.102: v22.66,34.19 22.66,33.07 22.15,32.56 9.55,32.56 9.45,32.46 5.59,32.46 3.45,34.6 3.45,53.7 M1.1
PWM_2  (via drill 0.2)
  Top 0.102: v21.95,34.9 20.93,34.9 STM32F722.15
  Bottom 0.102: v21.95,34.9 21.95,38 15.44,44.5 15.44,52.73 18.8,56.08 19.46,56.08 20.12,56.74 20.12,57.56 19.41,58.27 12.6,58.27 9.86,55.52 5.99,55.52 M2.1
PWM_3
  Top 0.102: M3.1 7.57,54.61 1.63,48.67 1.63,42.77 2.13,42.27 3.5,42.27 5.99,39.78 5.99,34.6 7.21,33.38 9.45,33.38 14.78,28.04 24.59,28.04 28.4,31.85 28.4,32.31 STM32F722.28
PWM_4  (via drill 0.2)
  Top 0.102: v9.25,32.92 14.33,27.84 24.89,27.84 28.91,31.85 28.91,32.31 STM32F722.29
  Bottom 0.102: v9.25,32.92 9.25,33.99 7.31,35.92 7.21,35.92 5.99,37.13 5.99,37.24 4.77,38.46 4.67,38.46 4.17,38.96 4.17,48.67 10.11,54.61 M4.1
RST  (via drill 0.2)
  Top 0.102: RESET.P$1 24.33,2.9 23.22,1.78 R13.1 22.4,1.78 21.89,2.29 v21.89,2.69 | v15.34,12.24 15.34,14.22 C31.2 | v23.57,38.86 20.93,38.86 STM32F722.7 | v51.51,49.43 59.59,49.43 JTAG.5 60.6,50.44 60.6,52.48 60.1,52.98 59.28,52.98 57.25,50.95 43.03,50.95 36.47,44.4 v34.75,44.4
  Bottom 0.102: v15.34,12.24 15.34,1.17 20.37,1.17 v21.89,2.69 21.89,2.64 22.71,2.64 24.23,1.12 55.93,1.12 57.1,2.29 57.1,22.86 ICSP.5 56.19,23.83 56.19,24.44 | 56.19,24.44 56.19,29.52 50.5,35.2 49.53,35.2 C35.1 | v23.57,38.86 24.59,38.86 24.74,39.01 C30.1 24.79,39.07 24.79,39.32 27.74,42.27 27.74,44.55 28.91,45.72 32.77,45.72 34.09,44.4 v34.75,44.4 | v51.51,49.43 51.51,42.88 50.19,41.55 48.77,41.55 ATMEGA328P.29 | 56.19,24.44 57.56,24.44 58.73,25.6 58.73,48.57 JTAG.5
SD1_CK  (via drill 0.2)
  Top 0.102: v28.19,42.77 28.4,42.98 28.4,43.84 STM32F722.53
  Bottom 0.102: v28.19,42.77 28.19,39.62 26.98,38.41 26.98,30.89 33.27,24.59 33.27,12.09 32.46,11.28 24.13,11.28 24.13,8.29 25.42,7 25.7,7 25.79,6.91 25.79,6.8 26.29,6.3 SD_CARD.5
SD1_CMD  (via drill 0.2)
  Top 0.102: v28.7,44.86 28.45,44.86 27.94,44.35 27.94,43.89 STM32F722.54 | v28.65,30.94 28.3,30.94 24.94,27.58 21.79,27.58 21.69,27.48 21.69,22.35 v24.64,19.41
  Bottom 0.102: v28.7,44.86 28.7,43.69 29.36,43.03 29.36,39.27 28.09,38 28.09,31.5 v28.65,30.94 | v24.64,19.41 24.64,15.29 23.88,14.53 23.88,12.53 22.71,11.36 22.71,8.54 23.88,7.37 23.88,6.56 SD_CARD.3
SD1_D0  (via drill 0.2)
  Top 0.102: v33.48,36.78 32.92,37.34 32.46,37.34 STM32F722.39 | v33.48,26.06 33.48,22.81 v31.9,21.23 | v20.17,20.22 19.81,19.86 v19.81,17.73
  Bottom 0.102: v33.48,26.06 v33.48,36.78 | v31.9,21.23 21.18,21.23 v20.17,20.22 | SD_CARD.7 27.99,5.75 27.99,5.29 26.29,3.58 22.34,3.58 19.81,6.11 v19.81,17.73
SPI1_MISO  (via drill 0.2)
  Top 0.102: v42.57,21.84 42.77,22.05 42.77,22.91 ICM20689.9 | v28.91,42.82 28.91,43.84 STM32F722.52
  Bottom 0.102: v42.57,21.84 37.03,21.84 27.89,30.99 27.89,39.01 28.91,40.03 v28.91,42.82
SPI1_MOSI
  Top 0.102: ICM20689.24 41.76,26.87 37.39,26.87 30.84,33.43 28.5,33.43 27.94,32.87 27.94,32.36 STM32F722.27
SPI1_NSS
  Top 0.102: ICM20689.22 42.77,26.87 42.77,28.04 38,32.82 31.75,32.82 27.89,36.68 25.35,36.68 24.44,35.76 24.44,32.36 STM32F722.20
SPI1_SCLK  (via drill 0.2)
  Top 0.102: v37.8,32.36 42.27,27.89 42.27,26.87 ICM20689.23 | v30.02,42.42 30.02,42.77 29.46,43.33 29.46,43.84 STM32F722.51
  Bottom 0.102: v37.8,32.36 37.8,34.44 30.02,42.21 v30.02,42.42
SPI2_MISO  (via drill 0.2)
  Top 0.102: v21.79,32.11 21.69,32.11 19.86,33.93 19.86,36.78 20.42,37.34 20.88,37.34 STM32F722.10 | v31.7,11.86 31.7,10.21 NRF24L01.MISO
  Bottom 0.102: v21.79,32.11 21.79,29.97 19.61,27.79 19.61,20.12 19.96,19.76 23.52,19.76 24.79,21.03 25.45,21.03 29.03,17.45 31.19,17.45 31.39,17.24 31.39,12.17 v31.7,11.86
SPI2_MOSI  (via drill 0.2)
  Top 0.102: v23.11,36.42 21.69,37.85 STM32F722.9 | v32.82,12.29 33.12,12.29 35.41,10.01 36.98,10.01 NRF24L01.MOSI
  Bottom 0.102: v23.11,36.42 23.11,30.99 19.81,27.69 19.81,21.39 20.07,21.13 20.78,21.13 21.34,21.69 32.11,21.69 32.82,20.98 v32.82,12.29
SPI2_NSS  (via drill 0.2)
  Top 0.102: v48.16,26.72 46.28,26.72 38.66,34.34 32.46,34.34 STM32F722.33 | v50.65,24.23 50.65,23.22 46.84,19.41 40.49,19.41 39.22,18.14 39.22,12.55 NRF24L01.CSN
  Bottom 0.102: v48.16,26.72 v50.65,24.23
SPI2_SCLK  (via drill 0.2)
  Top 0.102: v43.79,27.69 43.16,28.32 43.16,28.7 38.84,33.02 32.66,33.02 31.65,34.04 31.65,34.54 31.95,34.85 STM32F722.34 | v50.65,24.94 51.11,24.49 51.11,23.37 46.94,19.2 40.59,19.2 39.42,18.03 39.42,8.64 38.56,7.77 36.68,7.77 NRF24L01.SCK
  Bottom 0.102: v43.79,27.69 44.43,28.32 47.27,28.32 v50.65,24.94
SWCLK
  Top 0.102: JTAG.2 58.42,58.42 37.74,58.42 36.98,57.66 36.98,56.9 33.22,53.14 33.22,52.07 30.43,49.28 30.43,43.89 STM32F722.49
SWDIO
  Top 0.102: JTAG.4 58.37,50.75 43.13,50.75 33.27,40.89 32.46,40.89 STM32F722.46
SWO
  Top 0.102: JTAG.6 60.81,48.11 60.81,54.81 60.1,55.52 60,55.52 57.3,58.22 37.85,58.22 37.19,57.56 37.19,53.49 33.07,49.38 33.07,44.81 30.23,41.96 28.35,41.96 27.43,42.88 27.43,43.84 STM32F722.55
TRIGG1_IN
  Bottom 0.102: SONIC1.2 49.33,58.62 50.8,58.62 51.97,57.46 51.97,43.03 49.68,40.74 48.77,40.74 ATMEGA328P.30
TRIGG2_IN
  Bottom 0.102: SONIC2.2 48.26,49.99 46.48,48.21 46.48,46.23 ATMEGA328P.23
UART1_RX  (via drill 0.2)
  Top 0.102: v31.09,42.16 31.09,40.18 31.9,39.37 32.41,39.37 STM32F722.43 | v29.97,45.26 29.97,51.36 30.28,51.66 30.28,52.48 26.67,56.08 25.2,56.08 OSD.3 | v19.1,16.31 19.2,16.21 19.2,15.7 FT232RL.1 | v19.1,19.46 19.1,20.42 v20.27,21.59 | v27.94,29.26 29.06,30.38 v29.36,30.38
  Bottom 0.102: 31.09,42.88 31.09,44.15 v29.97,45.26 | 31.09,42.88 v31.09,42.16 | v19.1,19.46 v19.1,16.31 | v27.94,29.26 v20.27,21.59 | v29.36,30.38 29.82,30.38 33.02,33.58 33.02,38.76 29.57,42.21 29.57,42.62 29.82,42.88 31.09,42.88
UART1_TX  (via drill 0.2)
  Top 0.102: v26.98,42.82 28.63,41.17 | 28.63,41.17 30.94,38.86 32.41,38.86 STM32F722.42 | v16.56,13.06 19.2,13.06 FT232RL.5 | v20.27,25.5 v16.56,21.79 | 28.63,41.17 v27.74,40.28
  Bottom 0.102: v26.98,42.82 26.98,47.75 23.06,51.66 23.06,53.54 OSD.4 | v16.56,21.79 v16.56,13.06 | v20.27,25.5 20.27,27.84 26.77,34.34 26.77,39.32 v27.74,40.28
UART2_RX  (via drill 0.2)
  Top 0.102: v22.1,33.17 STM32F722.17 | v16.97,55.47 16.97,59.08 18.64,60.76 23.06,60.76 GPS.3
  Bottom 0.102: v22.1,33.17 22.1,34.09 15.24,40.95 15.24,53.75 v16.97,55.47
UART2_TX  (via drill 0.2)
  Top 0.102: v22.66,34.9 22.15,34.39 20.93,34.39 STM32F722.16 | v22.66,50.9 22.66,52.07 v24.38,53.8
  Bottom 0.102: v22.66,50.9 v22.66,34.9 | v24.38,53.8 24.79,53.8 27.74,56.74 27.74,58.62 GPS.4
USBDM
  Top 0.102: USB.D- 10.92,4.72 10.92,5.18 12.55,6.81 24.89,6.81 25.91,7.82 26.47,7.82 FT232RL.16
USBDP
  Top 0.102: USB.D+ 11.58,4.72 11.58,5.18 13,6.6 25.91,6.6 26.47,7.16 FT232RL.15
USBOSD  (via drill 0.2)
  Top 0.102: v36.73,43.69 33.43,40.39 32.46,40.39 STM32F722.45
  Bottom 0.102: v36.73,43.69 36.73,45.06 35.56,46.23 OSD/USB.2
V_USB  (via drill 0.2)
  Top 0.102: v7.82,4.72 10.21,4.72 USB.VBUS
  Bottom 0.102: v7.82,4.72 6.86,4.72 6.5,5.08 D1.A
VCC  (via drill 0.25, 0.3, 0.35)
  Top 0.203: 20.78,30.53 21.13,30.18 21.54,30.18 22.5,29.21 C7.1 | 20.78,30.53 17.88,33.43 | 17.88,33.43 17.48,33.83 17.48,34.29 C6.1 | LM3940-3.3.3 9.14,24.74 v8.94,24.54 | v21.95,13.82 21.84,13.72 19.25,13.72 FT232RL.4 | v20.73,30.43 20.73,30.48 20.78,30.53 | C41.2 49.12,23.83 C40.1 46.94,23.72 46.94,23.57 v46.08,22.71 | ICM20689.8 42.27,22.91 42.27,22.3 41.05,21.08 C42.2 41,21.03 41,20.32 38.71,18.03 38.71,14.58 NRF24L01.VCC 38.05,13.92 37.69,13.92 36.58,12.8 30.17,12.8 | v45.01,23.06 45.01,23.62 ICM20689.13 | LED6.A 4.98,7.62 4.98,6.81 8.03,3.76 16,3.76 17.98,1.78 R13.2 20.83,1.83 20.83,2.39 v22.55,4.12 24.74,6.3 30.02,6.3 30.17,6.45 30.17,12.8 | STM32F722.32 30.43,32.31 30.43,30.38 31.39,29.41 31.39,29.21 C5.1 31.5,29.16 31.5,28.3 32.31,27.48 32.31,22.86 29.06,19.61 C20.1 | C20.1 29.57,19.05 29.57,13.97 C19.1 29.62,13.92 30.17,13.36 30.17,12.8 | 26.52,22.05 29.46,19.1 C20.1 | 26.52,22.05 22.55,26.01 22.55,26.67 C16.1 | 26.52,22.05 v24.99,20.52 | C29.2 48.26,44.96 | 48.26,44.96 48.26,41.71 46.28,39.73 45.72,39.73 C4.1 | 49.53,38.05 49.53,37.49 49.17,37.13 49.07,37.13 BMP280.8 | 49.53,38.05 49.17,38.41 49.07,38.41 BMP280.6 | 52.15,38.38 52.63,38.86 53.8,38.86 53.9,38.96 53.9,41.1 | 52.15,38.38 51.87,38.1 49.58,38.1 49.53,38.05 | 53.9,41.1 TXB0104.1 51.26,41.91 50.09,43.08 v50.09,44.81 50.04,44.86 50.04,48.21 49.23,49.02 47.09,49.02 36.68,38.61 | 52.15,38.38 v51.97,38.56 | v56.39,41.81 55.73,41.15 53.95,41.15 53.9,41.1 | v47.65,44.96 48.26,44.96 | STM32F722.64 22.91,43.89 22.91,44.7 20.32,47.3 C2.1 20.27,47.3 6.04,47.3 GIMBAL_X.2 | GIMBAL_Y.2 GIMBAL_Z.2 6.25,42.01 6.25,39.37 7.62,38 DAC.2
  Top 0.203: GPS.1 19.05,58.27 | 19.05,58.27 OSD.1 | GY87.7 33.02,53.34 OSD/USB.1 31.9,58.27 19.05,58.27 | 34.14,45.01 34.29,45.16 C3.1 | 34.14,45.01 32.46,43.33 32.46,41.86 STM32F722.48 | 23.27,35.36 23.88,34.75 23.88,32.36 STM32F722.19 | 23.27,35.36 23.01,35.61 22.71,35.61 22.5,35.81 20.93,35.81 STM32F722.13 | v36.22,39.07 36.68,38.61 | 36.68,38.61 39.37,35.92 C17.1 | 23.27,35.36 25.45,37.54 25.45,41.66 v26.11,42.32 | v34.24,44.96 34.19,44.96 34.14,45.01 | v17.53,33.07 17.88,33.43 | v22.5,15.34 22.53,17.65 22.53,17.91 v22.53,17.78 C27.1
  Bottom 0.203: 8.94,24.49 10.16,24.49 C22.1 10.21,24.49 12.7,24.49 C32.1 12.75,24.38 14.94,24.38 | 8.94,24.49 7.62,24.49 C33.1 | v8.94,24.54 8.94,24.49 | v22.5,15.34 22.5,14.38 v21.95,13.82 | v20.73,30.43 20.73,30.18 14.94,24.38 | NRF24L01.VCC 38.1,16.76 40.59,19.25 41.2,19.25 v45.01,23.06 45.36,22.71 v46.08,22.71 | 51.97,37.69 53.09,37.69 C38.2 | 51.97,37.69 50.8,37.69 C37.2 | v51.97,38.56 51.97,37.69 | JTAG.1 56.79,56.79 56.79,47.04 R2.2 56.74,46.99 56.74,44.45 R3.2 56.64,44.4 56.39,44.15 v56.39,41.81 | v47.65,44.96 47.75,44.96 48.01,45.21 49.68,45.21 v50.09,44.81 | GIMBAL_Y.2 GIMBAL_X.2 5.13,48.31 6.3,48.31 13.97,55.98 17.88,55.98 OSD.1 | R5.2 27.94,48.77 29.77,46.94 29.77,46.74 | 29.77,46.74 29.87,46.63 31.09,46.63 31.19,46.74 | 31.19,46.74 31.19,48.36 30.48,49.07 R4.2 30.53,49.17 31.75,50.39 GY87.7 | v36.22,39.07 36.22,43.69 34.59,45.31 | 34.59,45.31 33.22,46.69 31.75,46.69 | 31.75,46.69 31.24,46.69 31.19,46.74 | v26.11,42.32 27.23,42.32 27.48,42.57 27.48,44.7 29.17,46.39 | 29.17,46.39 29.46,46.69 29.72,46.69 29.77,46.74 | 34.59,45.31 v34.24,44.96 | v17.53,33.07 11.38,33.07 DAC.2 | 29.17,46.39 28.23,46.39 v27.81,45.97 | 31.75,46.69 31.75,46.48 v32,46.23 | SD_CARD.4 24.74,5.6 24.74,5.46 24.62,5.35 23.78,5.35 v22.55,4.12 | v24.99,20.52 24.64,20.52 23.63,19.51 22.61,19.51 | 14.94,24.38 14.98,24.38 19.86,19.51 22.61,19.51 | v22.53,17.78 22.61,19.51
  pour Top: 63.5,0 63.5,63.12 0,63.12 0,-0.13 63.37,-0.13
VCC_2  (via drill 0.25)
  Top 0.203: 59.59,41.91 60.66,41.91 60.96,41.6 C28.2 | 59.59,41.91 TXB0104.14 58.62,41.96 57,41.96 49.53,49.43 v43.74,49.43 | v59.59,41.25 59.59,41.91 | ICSP.2 58.62,27.94 57.45,26.77 54.3,26.77 52.83,25.3 PPM.2 | LED.1 34.19,59.69 35.15,60.66 44.76,60.66 SONIC1.1 | FT232RL.20 26.47,10.47 25.86,10.47 25.5,10.82 25.5,11.02 22.15,14.38 21.79,14.38 19.36,16.82 18.85,16.82 18.54,16.51 C18.1 17.37,16.56 17.22,16.56 16.31,17.48 13.36,17.48 12.55,16.66 6.15,16.66 5.03,17.78 LED2.A | M1.2 M2.2 M3.2 M4.2 | 5.28,23.37 5.28,20.62 4.98,20.32 LED1.A 4.93,20.27 LED2.A | 5.28,23.37 5.28,24.74 LM3940-3.3.1 | LED2.A | ADC2.2 ADC1.2 | v5.23,23.37 5.28,23.37
  Bottom 0.203: v59.59,41.25 59.59,37.08 59.54,37.03 59.54,28.09 ICSP.2 | C21.1 41.81,20.32 44.45,22.96 44.45,23.27 44.91,23.72 51.31,23.72 52.83,25.25 PPM.2 | 43.64,38.46 43.28,38.1 43.28,37.64 ATMEGA328P.6 | 43.64,38.46 44.45,38.46 44.81,38.1 44.81,37.64 ATMEGA328P.4 | 42.88,49.43 42.88,48.31 C13.1 42.82,48.26 42.47,47.9 42.47,46.23 ATMEGA328P.18 42.52,46.13 42.52,45.72 43.59,44.65 43.59,38.51 43.64,38.46 | 42.88,49.43 42.88,50.8 C14.1 42.88,50.85 42.88,53.34 C15.1 42.93,53.39 42.93,54.36 43.75,55.18 | SONIC1.1 SONIC2.1 43.75,55.18 | C34.1 2.54,24.49 5.08,24.49 C23.1 5.13,24.38 5.23,24.28 v5.23,23.37 | D1.C 2.44,5.08 2.44,24.33 2.49,24.38 C34.1 | C34.1 2.49,24.54 1.57,25.45 1.57,34.7 2.54,35.66 ADC1.2 1.57,37.8 1.57,55.02 2.54,55.98 M1.2 | LED.1 28.24,59.69 27.08,60.86 13.87,60.86 M4.2 | 42.88,49.43 v43.74,49.43 | 43.75,55.18

## Text on the board
Top: SHARKSKY F7 / V 1.0b
tNames: ULTRASONIC | MOTORS | GIMBAL | 1 | 1 | 1 | 1 | 1 | ADC & DAC | 1 | 1 | SHARKSKY F7 V 1.0b / (C) CHARPOAN KONG | 1 | 1
bNames: GND | GND | 3V3 | 5V | SENS | SWCLK | 3V3 | GND | RX | TX | 5V 3V3 | SIG | GND | 5V | TRG | ECHO | GND | SIG | GND | SWDIO | SIG | 3V3 | GND | DRDY | INT | FSYNC | SDA | SCL | GND | 3V3 | VCC | RST | SWO | GND | 5V 3V3 | 1 | 1 | SIG | PPM_IN | MISO | 5V | SCLK | MOSI | 5V | GND | RST | GND | SHARKSKY F7 V 1.0b / (C) CHARPOAN KONG